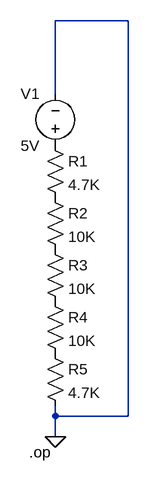
[diagram p0: schematic 3-1_Resistor-Ladder-Example.asc]
3-1_Resistor-Ladder-Example.asc, the LTspice schematic file:
Version 4.1
SHEET 1 880 680
WIRE 288 -224 176 -224
WIRE 176 -112 176 -224
WIRE 176 384 176 368
WIRE 288 384 288 -224
WIRE 288 384 176 384
WIRE 176 416 176 384
FLAG 176 416 0
SYMBOL res 160 -48 R0
SYMATTR InstName R1
SYMATTR Value 4.7K
SYMATTR SpiceLine tol=1 pwr=0.1
SYMBOL res 160 32 R0
SYMATTR InstName R2
SYMATTR Value 10K
SYMBOL res 160 112 R0
SYMATTR InstName R3
SYMATTR Value 10K
SYMBOL res 160 192 R0
SYMATTR InstName R4
SYMATTR Value 10K
SYMBOL res 160 272 R0
SYMATTR InstName R5
SYMATTR Value 4.7K
SYMBOL voltage 176 -16 R180
WINDOW 0 24 96 Left 2
WINDOW 3 24 16 Left 2
WINDOW 123 0 0 Left 0
WINDOW 39 0 0 Left 0
SYMATTR InstName V1
SYMATTR Value 5V
TEXT 136 440 Left 2 !.op

The netlist it stands for:
* 3-1_Resistor-Ladder-Example.asc
R1 P001 P002 4.7K tol=1 pwr=0.1
R2 P002 P003 10K
R3 P003 P004 10K
R4 P004 P005 10K
R5 P005 0 4.7K
V1 P001 0 5V
.op
.backanno
.end

* Results of the author's LTspice run, read from the files saved beside the schematic
* Operating Point:
*   V(p001) = 5 V
*   V(p002) = 4.404 V
*   V(p003) = 3.135 V
*   V(p004) = 1.865 V
*   V(p005) = 596.4 mV
*   I(R1) = 126.9 µA
*   I(R2) = 126.9 µA
*   I(R3) = 126.9 µA
*   I(R4) = 126.9 µA
*   I(R5) = 126.9 µA
*   I(V1) = -126.9 µA